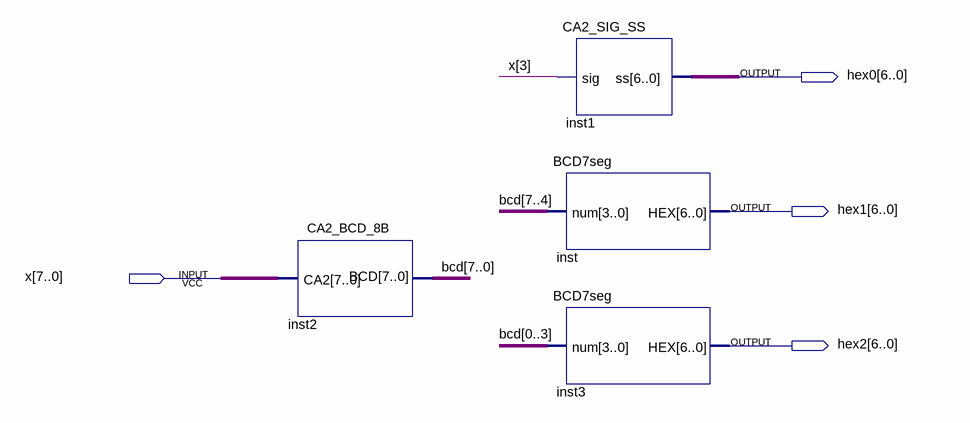
[diagram p0: schematic sheet]
// Quartus schematic CA2_SS_8B.bdf as structural Verilog: 4 symbols, 4 pins
module CA2_SS_8B (
  input  [7:0] x,
  output [6:0] hex0,
  output [6:0] hex1,
  output [6:0] hex2
);

  wire [7:0] bcd;

  CA2_BCD_8B inst2 (.CA2(x), .BCD(bcd));
  CA2_SIG_SS inst1 (.sig(x[3]), .ss(hex0));
  BCD7seg inst (.num(bcd[7:4]), .HEX(hex1));
  BCD7seg inst3 (.num({bcd[0], bcd[1], bcd[2], bcd[3]}), .HEX(hex2));
endmodule
